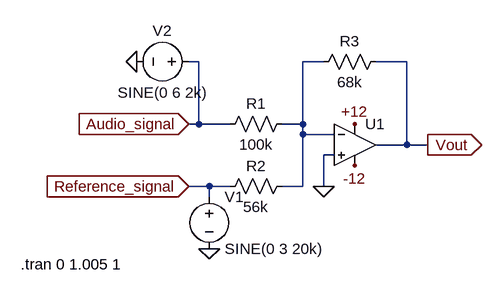
[diagram p0: schematic summing_amplifier.asc]
summing_amplifier.asc, the LTspice schematic file:
Version 4
SHEET 1 880 680
WIRE 64 32 48 32
WIRE 256 32 224 32
WIRE 384 32 336 32
WIRE 64 128 64 32
WIRE 64 128 48 128
WIRE 112 128 64 128
WIRE 224 128 224 32
WIRE 224 128 192 128
WIRE 224 144 224 128
WIRE 272 144 224 144
WIRE 384 160 384 32
WIRE 384 160 336 160
WIRE 416 160 384 160
WIRE 272 176 256 176
WIRE 80 224 48 224
WIRE 112 224 80 224
WIRE 224 224 224 144
WIRE 224 224 192 224
WIRE 256 224 256 176
WIRE 80 240 80 224
FLAG 256 224 0
FLAG 304 128 +12
FLAG 304 192 -12
FLAG 48 128 Audio_signal
IOPIN 48 128 In
FLAG 48 224 Reference_signal
IOPIN 48 224 In
FLAG 416 160 Vout
IOPIN 416 160 Out
FLAG 80 320 0
FLAG -32 32 0
SYMBOL res 208 112 R90
WINDOW 0 0 56 VBottom 2
WINDOW 3 32 56 VTop 2
SYMATTR InstName R1
SYMATTR Value 100k
SYMBOL res 208 208 R90
WINDOW 0 0 56 VBottom 2
WINDOW 3 32 56 VTop 2
SYMATTR InstName R2
SYMATTR Value 56k
SYMBOL OpAmps\\UniversalOpAmp2 304 160 R0
SYMATTR InstName U1
SYMBOL res 352 16 R90
WINDOW 0 0 56 VBottom 2
WINDOW 3 32 56 VTop 2
SYMATTR InstName R3
SYMATTR Value 68k
SYMBOL voltage 80 224 R0
WINDOW 123 0 0 Left 0
WINDOW 39 0 0 Left 0
SYMATTR InstName V1
SYMATTR Value SINE(0 3 20k)
SYMBOL voltage 64 32 R90
WINDOW 0 -32 56 VBottom 2
WINDOW 3 32 56 VTop 2
WINDOW 123 0 0 Left 0
WINDOW 39 0 0 Left 0
SYMATTR InstName V2
SYMATTR Value SINE(0 6 2k)
TEXT -210 344 Left 2 !.tran 0 1.005 1

The netlist it stands for:
* summing_amplifier.asc
R1 N001 Audio_signal 100k
R2 N001 Reference_signal 56k
XU1 0 N001 +12 -12 Vout level2 Avol=1Meg GBW=10Meg Slew=10Meg Ilimit=25m Rail=0 Vos=0 En=0 Enk=0 In=0 Ink=0 Rin=500Meg  ; pins In+ In- V+ V- OUT
R3 Vout N001 68k
V1 Reference_signal 0 SINE(0 3 20k)
V2 Audio_signal 0 SINE(0 6 2k)
.tran 0 1.005 1
.lib UniversalOpAmp2.lib
.backanno
.end